# EAGLE design newimu (EAGLE 9.6.2)
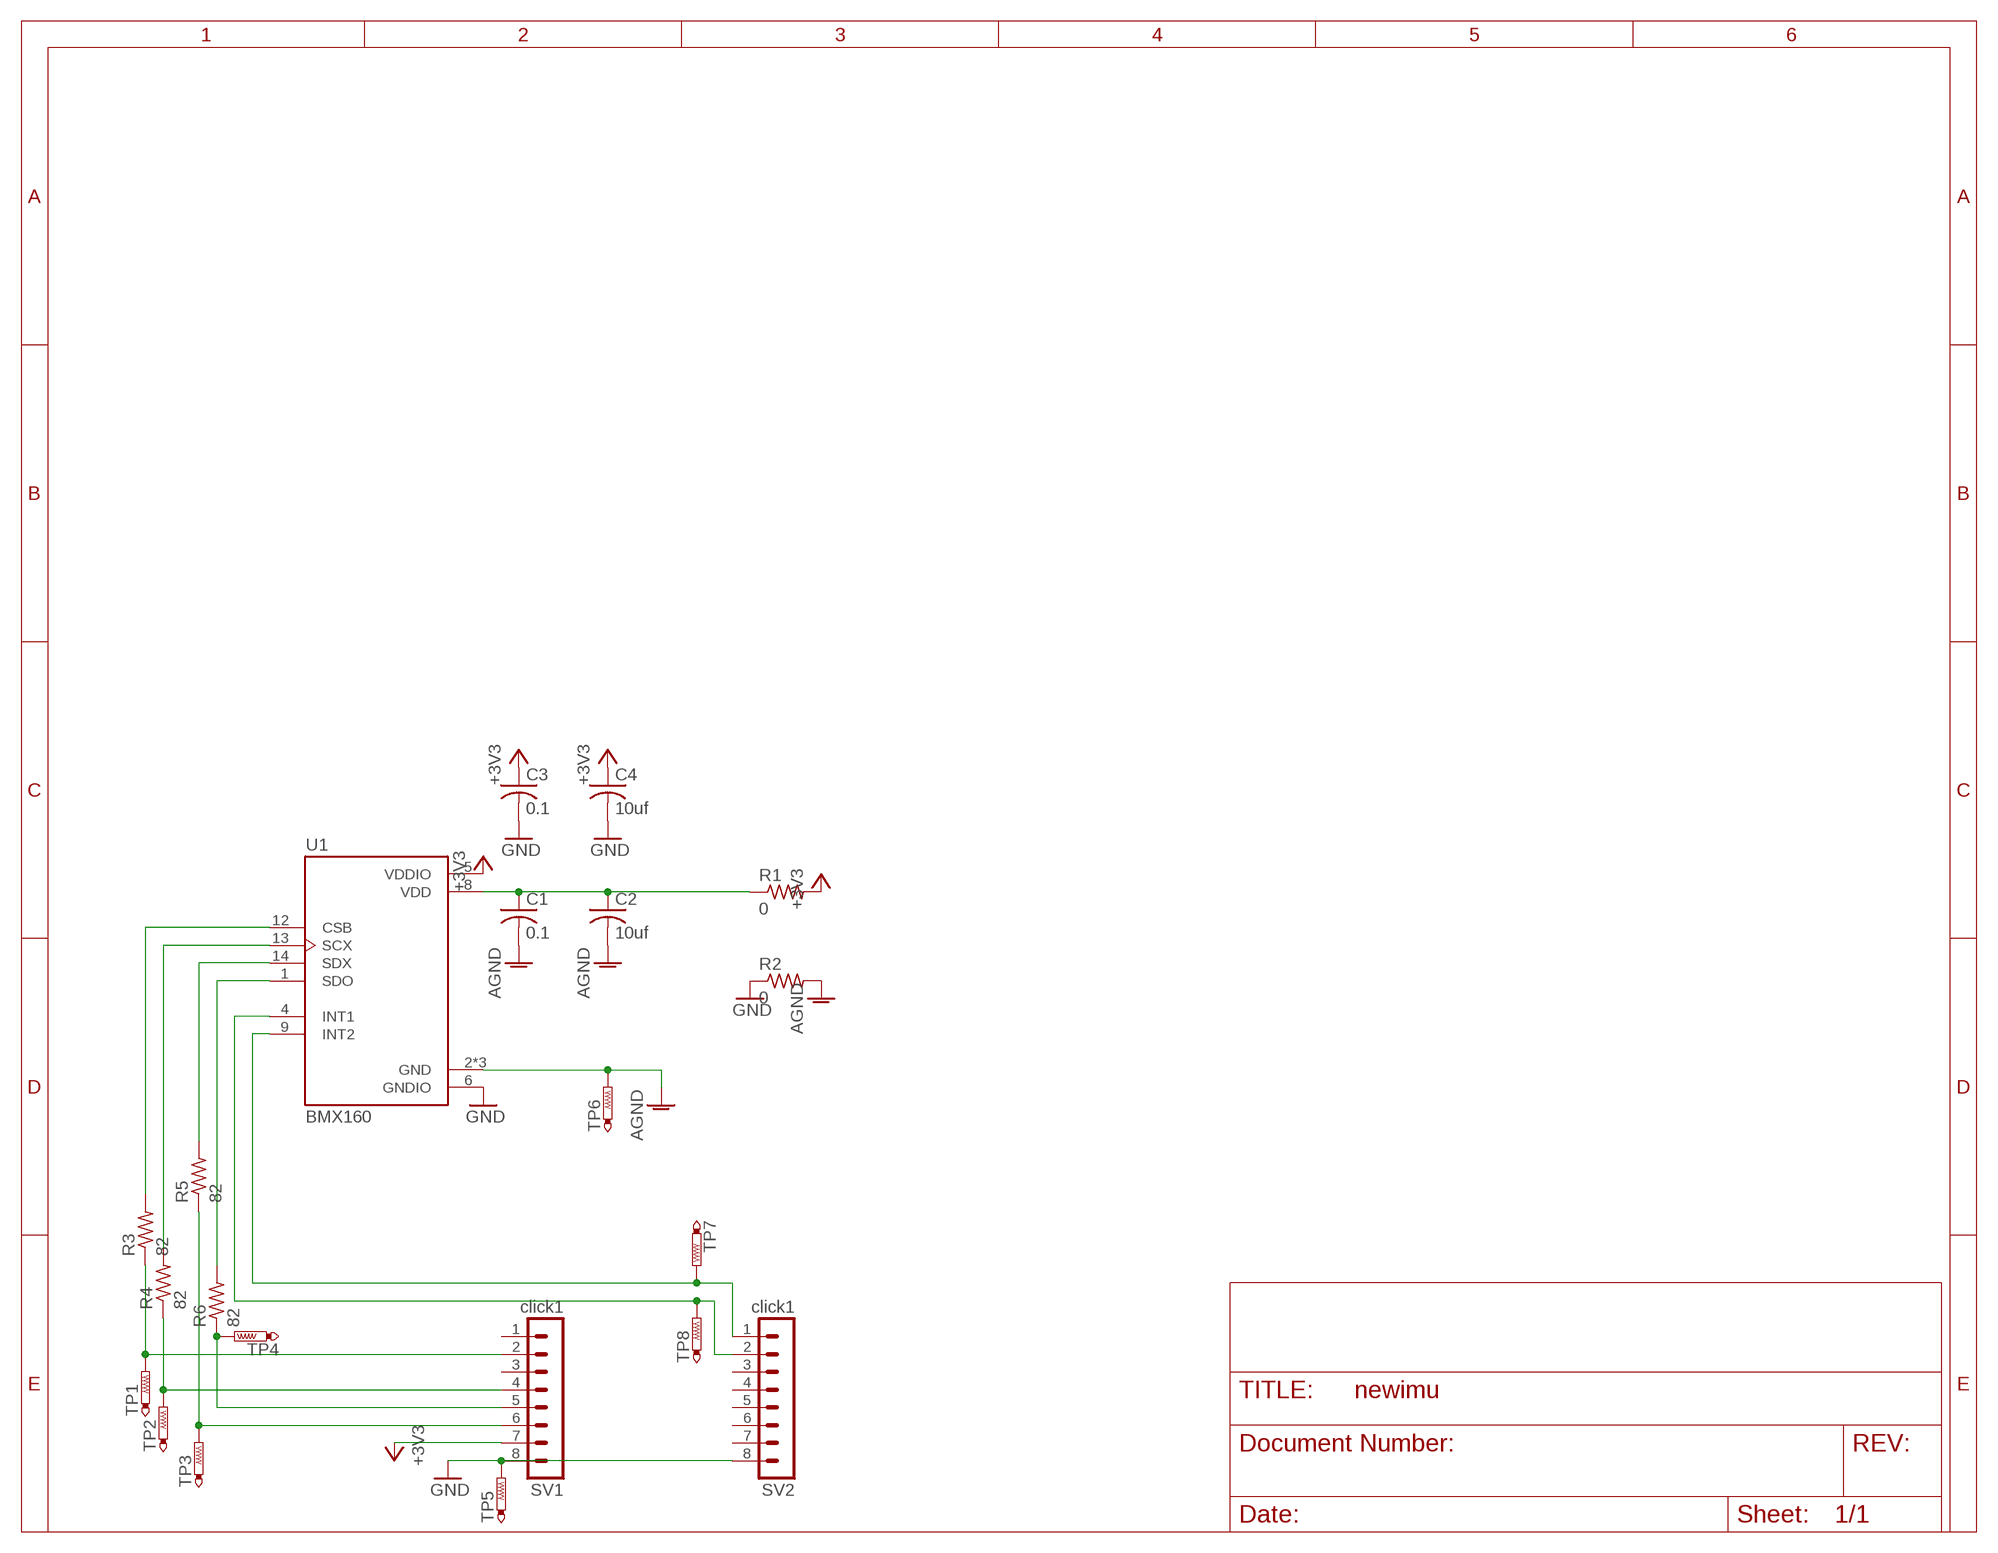
[diagram p0: schematic, sheet 1]

## Parts
C1  0.1  C-USC0805  [C0805]
C2  10uf  C-USC0805  [C0805]
C3  0.1  C-USC0805  [C0805]
C4  10uf  C-USC0805  [C0805]
R1  0  R-US_M0805  [M0805]
R2  0  R-US_M0805  [M0805]
R3  82  R-US_M0805  [M0805]
R4  82  R-US_M0805  [M0805]
R5  82  R-US_M0805  [M0805]
R6  82  R-US_M0805  [M0805]
SV1  click1  MA08-1  [MA08-1]
SV2  click1  MA08-1  [MA08-1]
TP1  PTR1B1,27  [B1,27]
TP2  PTR1B1,27  [B1,27]
TP3  PTR1B1,27  [B1,27]
TP4  PTR1B1,27  [B1,27]
TP5  PTR1B1,27  [B1,27]
TP6  PTR1B1,27  [B1,27]
TP7  PTR1B1,27  [B1,27]
TP8  PTR1B1,27  [B1,27]
U1  BMX160  [PQFN50P250X300X100-14N]

## Nets
+3V3 [icurrent]: C3.1 C4.1 R1.2 SV1.7 U1.5(VDDIO)
AGND [icurrent]: C1.2 C2.2 R2.2 TP6.TP U1.2(GND) U1.3(GND) U1.7(GND)
GND [icurrent]: C3.2 C4.2 R2.1 SV1.8 SV2.8 TP5.TP U1.6(GNDIO)
N$1: R4.2 U1.13(SCX)
N$2: SV2.1 TP7.TP U1.9(INT2)
N$3: SV2.2 TP8.TP U1.4(INT1)
N$4: R6.2 U1.1(SDO)
N$5: R5.1 SV1.6 TP3.TP
N$6: R3.1 SV1.2 TP1.TP
N$7 [icurrent]: C1.1 C2.1 R1.1 U1.8(VDD)
N$8: R3.2 U1.12(CSB)
N$9: R4.1 SV1.4 TP2.TP
N$10: R5.2 U1.14(SDX)
N$11: R6.1 SV1.5 TP4.TP
Unconnected: SV1.1 SV1.3 SV2.3 SV2.4 SV2.5 SV2.6 SV2.7

## Library data of the parts
C1-C4 = rcl:C-US: CAPACITOR, American symbol; SPICEPREFIX: C
R1-R6 = rcl:R-US_: RESISTOR, American symbol; SPICEPREFIX: R
SV1 SV2 = con-lstb:MA08-1: PIN HEADER; OC_FARNELL: unknown; OC_NEWARK: unknown
TP1-TP8 = testpad:PTR1: TEST PIN
U1 = BMX160:BMX160: IMU ACCEL/GYRO/MAG Check prices <https://pricing.snapeda.com/parts/BMX160/Bosch%20Sensortec/view-part?ref=eda>; AVAILABILITY: Good; DESCRIPTION: Accelerometer, Gyroscope, Magnetometer, 9 Axis Sensor I²C, SPI Output; MF: Bosch Sensortec; MP: BMX160; PACKAGE: VFLGA-14 Bosch Sensortec; PRICE: None; PURCHASE-URL: https://pricing.snapeda.com/search/part/BMX160/?ref=eda

## Net classes
1 icurrent: width 0.305 mm

## Board
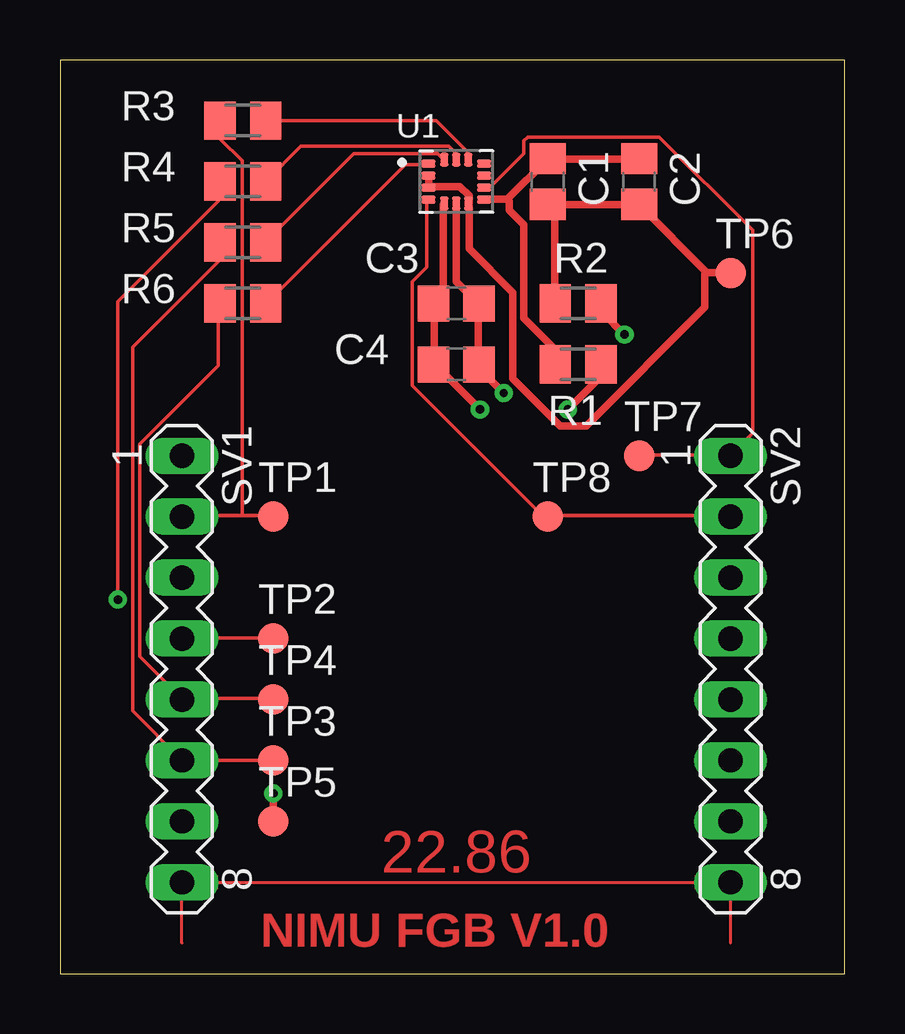
[diagram p1: board, top side]
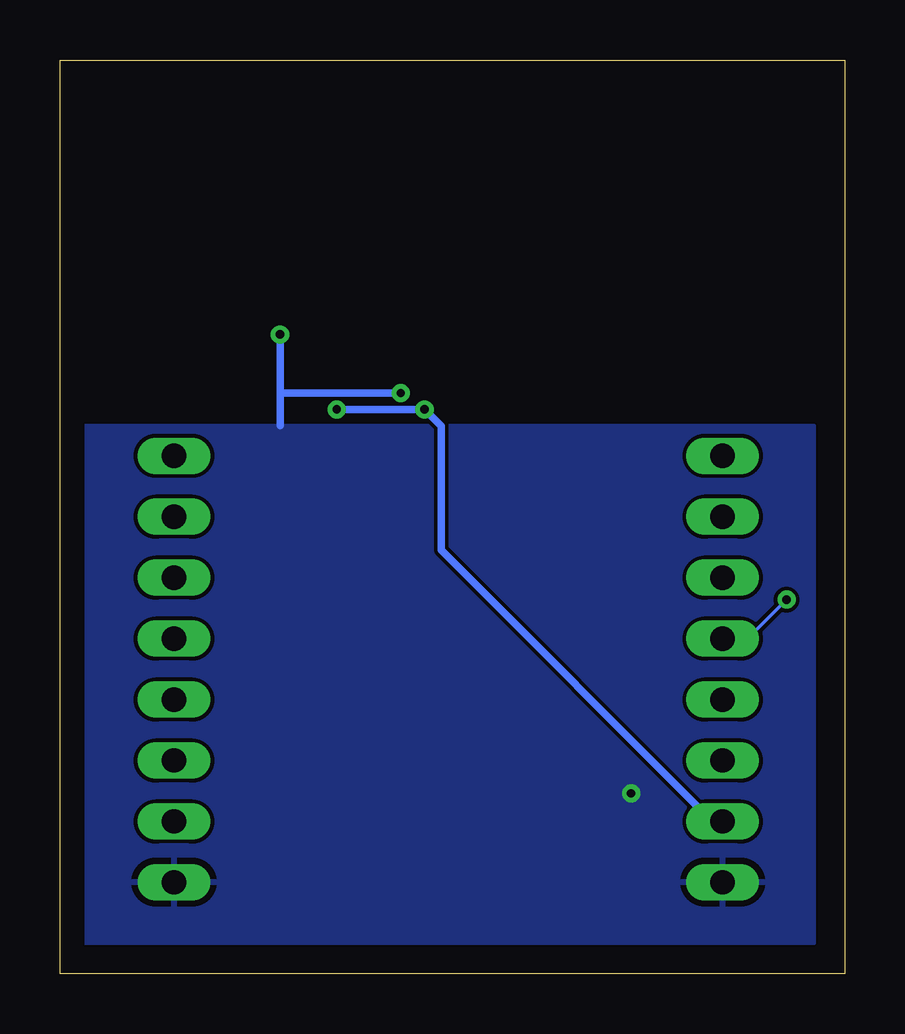
[diagram p2: board, bottom side, seen from below]

Size 32.69 x 38.09 mm. Coordinates in mm from the lower left corner, seen from the top.
Outline: 0,0 32.69,0 32.69,38.09 0,38.09 0,0
Copper layers (1*16): Top 0.035mm / dielectric 1.5mm / Bottom 0.035mm
Design rules "default": minimum track width 6mil, minimum drill 0.35mm, track to track 6mil, track to pad 6mil, pad to pad 6mil, via to via 6mil, smd to smd 6mil, copper to edge 40mil, drill to drill 6mil, minimum pad ring 10mil, minimum via ring 8mil, stop-mask expansion 4mil, vias tented up to drill 0mil, thermal gap 10mil

### Footprints (pad centres in the part's own frame; a part is rotated, then mirrored left to right if it is on the bottom)
C0805 = smd 1.3 x 1.5: 1 -0.95,0; 2 0.95,0
M0805 = smd 1.3 x 1.6: 1 -0.95,0; 2 0.95,0
MA08-1 = drill 1.016 long: 1 -8.89,0; 2 -6.35,0; 3 -3.81,0; 4 -1.27,0; 5 1.27,0; 6 3.81,0; 7 6.35,0; 8 8.89,0
B1,27 = smd 1.27 x 1.27: TP 0,0
PQFN50P250X300X100-14N = smd 0.58 x 0.35: 1 -1.16,0.75; 2 -1.16,0.25; 3 -1.16,-0.25; 4 -1.16,-0.75; 8 1.16,-0.75; 9 1.16,-0.25; 10 1.16,0.25; 11 1.16,0.75 | smd 0.35 x 0.58: 5 -0.5,-0.91; 6 0,-0.91; 7 0.5,-0.91; 12 0.5,0.91; 13 0,0.91; 14 -0.5,0.91

### Placement (x,y rotation side)
C1  20.32,33.02 270 top
C2  24.13,33.02 270 top
C3  16.51,27.94 0 top
C4  16.51,25.4 0 top
R1  21.59,25.4 0 top
R2  21.59,27.94 180 top
R3  7.62,35.56 0 top
R4  7.62,33.02 0 top
R5  7.62,30.48 0 top
R6  7.62,27.94 0 top
SV1  5.08,12.7 270 top
SV2  27.94,12.7 270 top
TP1  8.89,19.05 0 top
TP2  8.89,13.97 0 top
TP3  8.89,8.89 0 top
TP4  8.89,11.43 0 top
TP5  8.89,6.35 0 top
TP6  27.94,29.21 0 top
TP7  24.13,21.59 0 top
TP8  20.32,19.05 0 top
U1  16.51,33.02 0 top

### Tracks (layer width: path | path; a pad name or v marks a point on that pad's centre or on a via)
+3V3  (via drill 0.35)
  Top 0.305: U1.5 15.98,32.05 15.98,28.32 15.6,27.94 C3.1 15.6,27.86 15.6,25.43 C4.1 15.67,25.35 v17.5,23.52 | v21.16,23.52 22.53,24.89 22.53,25.35 R1.2
  Bottom 0.305: v21.16,23.52 v17.5,23.52 16.81,22.84 16.81,17.65 5.54,6.37 5.08,6.37 SV1.7
AGND
  Top 0.305: U1.2 15.37,33.2 15.37,32.82 U1.3 15.52,32.82 16.66,32.82 17.04,32.44 17.04,32.13 U1.7 17.04,31.98 17.04,30.23 18.87,28.4 18.87,24.82 20.85,22.84 21.92,22.84 26.87,27.79 26.87,29.16 26.95,29.23 | 26.95,29.23 27.94,29.23 TP6.TP | 26.95,29.23 24.13,32.05 C2.2 24.05,32.05 20.32,32.05 C1.2 20.62,31.98 20.62,27.94 R2.2
GND  (via drill 0.35)
  Top 0.305: v23.52,26.64 22.61,27.56 22.61,27.94 R2.1 | U1.6 16.51,28.85 17.42,27.94 C3.2 17.42,27.86 17.42,25.43 C4.2 17.42,25.27 v18.49,24.21 | v8.89,7.52 TP5.TP
  Bottom 0.305: 23.52,22.86 23.52,24.21 | 23.52,24.21 v23.52,26.64 | v18.49,24.21 23.52,24.21
  pour Bottom: 1.27,22.86 31.75,22.86 31.75,1.27 1.27,1.27
N$1
  Top 0.152: U1.13 16.51,34.19 16.2,34.49 10.03,34.49 8.58,33.05 R4.2
N$2
  Top 0.152: 27.94,21.62 28.85,22.53 28.85,30.99 24.97,34.87 19.48,34.87 19.33,34.72 19.33,34.19 17.96,32.82 17.73,32.82 U1.9 | 27.94,21.62 24.13,21.62 TP7.TP | 27.94,21.62 SV2.1
N$3
  Top 0.152: 20.32,19.1 20.09,19.1 14.68,24.51 14.68,28.85 15.29,29.46 15.29,32.21 U1.4 | 20.32,19.1 27.94,19.1 SV2.2 | 20.32,19.1 TP8.TP
N$4
  Top 0.152: U1.1 15.29,33.73 14.38,33.73 8.58,27.94 R6.2
N$5
  Top 0.152: TP3.TP SV1.6 3.02,10.95 3.02,26.11 6.6,29.69 6.6,30.45 R5.1
N$6
  Top 0.152: 7.59,19.1 5.08,19.1 SV1.2 | 7.59,19.1 8.89,19.1 TP1.TP | 7.59,19.1 7.59,33.88 6.68,34.8 R3.1
N$7
  Top 0.305: 18.64,32.28 17.73,32.28 U1.8 | 18.64,32.28 C1.1 20.4,33.96 C2.1 | R1.1 20.62,25.43 20.62,26.04 19.33,27.33 19.33,31.22 18.72,31.83 18.72,32.21 18.64,32.28
N$8
  Top 0.152: R3.2 15.67,35.56 16.97,34.27 16.97,33.96 U1.12
N$9  (via drill 0.35)
  Top 0.152: TP2.TP 8.89,14 5.08,14 SV1.4 | v2.41,15.6 2.41,28.02 6.6,32.21 6.6,32.97 R4.1
  Bottom 0.152: v2.41,15.6 4.01,14 5.08,14 SV1.4
N$10
  Top 0.152: U1.14 15.98,33.96 15.75,34.19 12.24,34.19 8.58,30.53 R5.2
N$11
  Top 0.152: 5.08,11.48 8.89,11.48 TP4.TP | 5.08,11.48 3.33,13.23 3.33,22.07 6.6,25.35 6.6,27.94 R6.1 | 5.08,11.48 SV1.5
(copper drawn outside any net)
  shapes: Top area x1

### Text on the board
Top: NIMU FGB V1.0